# Altium schematic sheet Power&CH341A.SchDoc
size A4
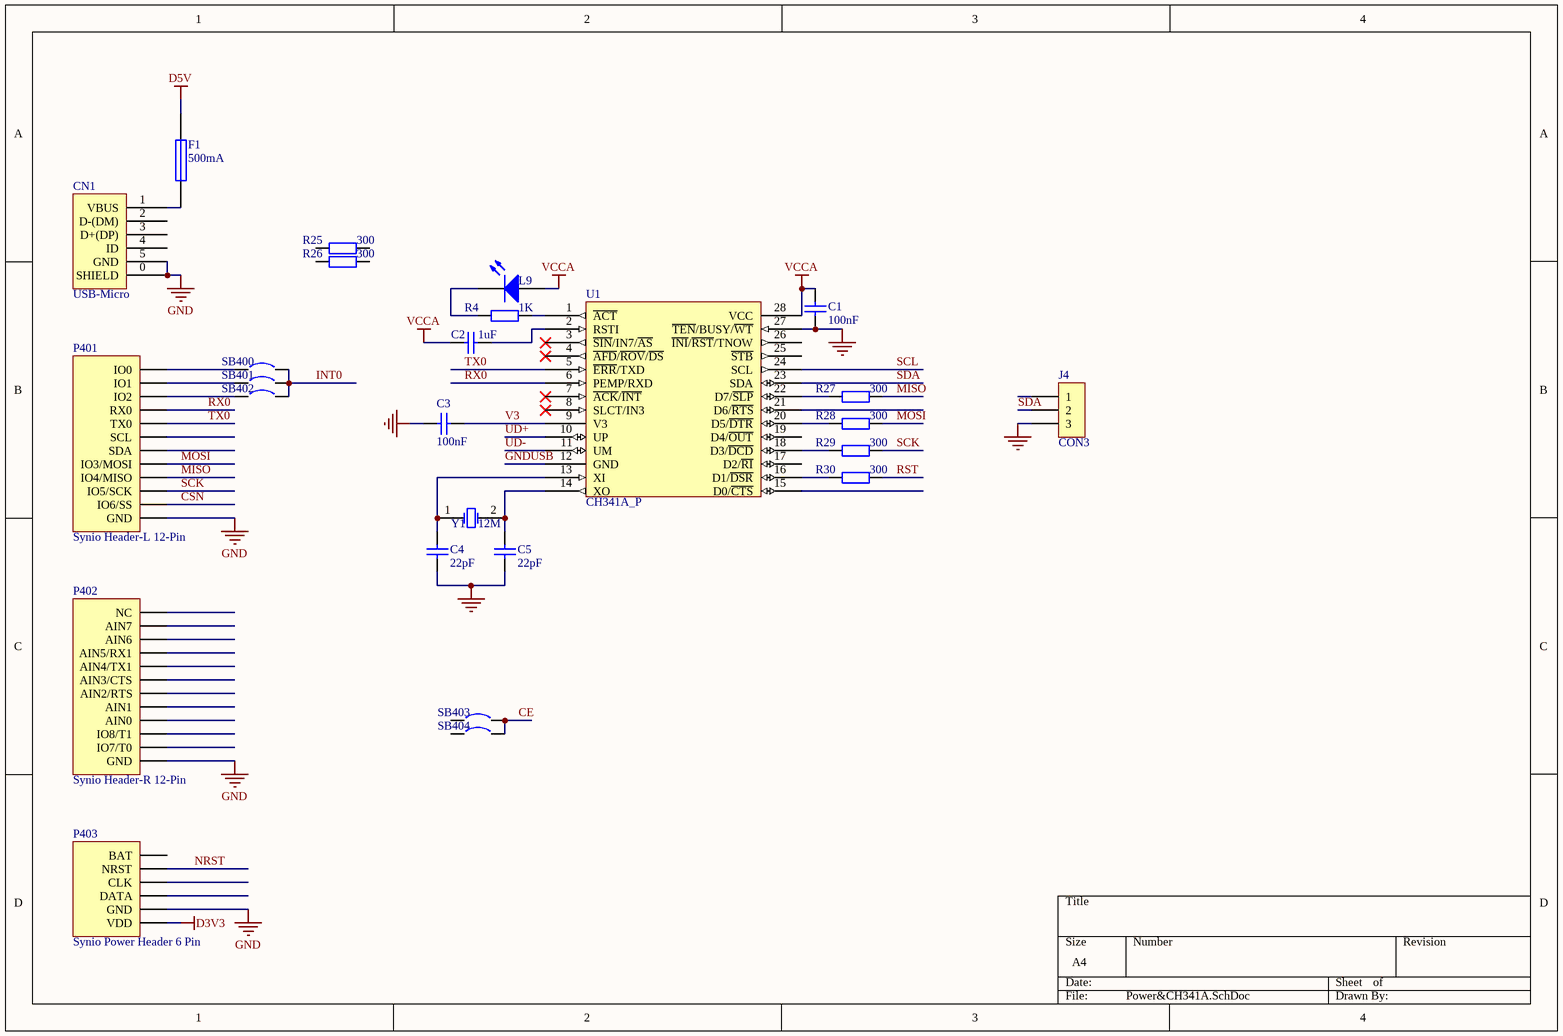
[diagram p0: Power&CH341A.SchDoc]

## Parts
C1  value 100nF  [C0603L]  (hidden comment: Cap)
C2  value 1uF  [C0603L]  (hidden comment: Cap)
C3  value 100nF  [C0603L]  (hidden comment: Cap)
C4  value 22pF  [C0603L]  (hidden comment: Cap)
C5  value 22pF  [C0603L]  (hidden comment: Cap)
CN1  USB-Micro  [USB-MICRO-Female-Lite]
F1  500mA  [0805]
J4  CON3  [HDR1X3]
L9  LED  [0603pn]  (value not drawn)
P401  Synio Header-L 12-Pin  [HDR1X12-L/2.54MM]
P402  Synio Header-R 12-Pin  [HDR1X12-L/2.54MM]
P403  Synio Power Header 6 Pin  [HDR1X6-L/2.54MM]
R4  value 1K  [R0603]  (hidden comment: Res)
R25  value 300  [R0603]  (hidden comment: Res)
R26  value 300  [R0603]  (hidden comment: Res)
R27  value 300  [R0603]  (hidden comment: Res)
R28  value 300  [R0603]  (hidden comment: Res)
R29  value 300  [R0603]  (hidden comment: Res)
R30  value 300  [R0603]  (hidden comment: Res)
SB400  Circuit Breaker  [JP2_SMD]  (value not drawn)
SB401  Circuit Breaker  [JP2_SMD]  (value not drawn)
SB402  Circuit Breaker  [JP2_SMD]  (value not drawn)
SB403  Circuit Breaker  [JP2_SMD]  (value not drawn)
SB404  Circuit Breaker  [JP2_SMD]  (value not drawn)
U1  CH341A_P  [SO28_M]
Y1  value 12M  [XTAL_49S]  (hidden comment: XTAL)

## Nets
D3V3: P403.1(VDD)
D5V: F1.1
GND: CN1.0(SHIELD) CN1.5(GND) P401.1(GND) P402.1(GND) P403.2(GND)
GNDUSB: C1.1 C3.2 C4.1 C5.1 J4.3 U1.12(GND) U1.27(~{TEN}/BUSY/~{WT})
VCCA: C1.2 C2.2 L9.1(A) U1.28(VCC)
CE: SB403.2 SB404.2
CSN: P401.2(IO6/SS)
INT0: SB400.2 SB401.2 SB402.2
MISO: P401.4(IO4/MISO) R27.2
MOSI: P401.5(IO3/MOSI) R28.2
NRST: P403.5(NRST)
RST: R30.2
RX0: P401.9(RX0) U1.6(PEMP/RXD)
SCK: P401.3(IO5/SCK) R29.2
SCL: U1.24(SCL)
SDA: J4.2 U1.23(SDA)
TX0: P401.8(TX0) U1.5(~{ERR}/TXD)
UD+: U1.10(UP)
UD-: U1.11(UM)
V3: C3.1 U1.9(V3)
NetC2_1: C2.1 U1.2(RSTI)
NetC4_2: C4.2 U1.13(XI) Y1.1(OSC1)
NetC5_2: C5.2 U1.14(XO) Y1.2(OSC2)
NetCN1_1: CN1.1(VBUS) F1.2
NetL9_2: L9.2(K) R4.1
NetP401_10: P401.10(IO2) SB402.1
NetP401_11: P401.11(IO1) SB401.1
NetP401_12: P401.12(IO0) SB400.1
NetR4_2: R4.2 U1.1(~{ACT})
NetR27_1: R27.1 U1.22(D7/~{SLP})
NetR28_1: R28.1 U1.20(D5/~{DTR})
NetR29_1: R29.1 U1.18(D3/~{DCD})
NetR30_1: R30.1 U1.16(D1/~{DSR})

Not connected (* = marked no-connect by the designer): CN1 2(D-(DM)) 3(D+(DP)) 4(ID); J4 1; P401 6(SDA) 7(SCL); P402 2(IO7/T0) 3(IO8/T1) 4(AIN0) 5(AIN1) 6(AIN2/RTS) 7(AIN3/CTS) 8(AIN4/TX1) 9(AIN5/RX1) 10(AIN6) 11(AIN7) 12(NC); P403 3(DATA) 4(CLK) 6(BAT); R25 1 2; R26 1 2; SB403 1; SB404 1; U1 3(~{SIN}/IN7/~{AS})* 4(~{AFD}/~{ROV}/~{DS})* 7(~{ACK}/~{INT})* 8(SLCT/IN3)* 15(D0/~{CTS}) 17(D2/~{RI}) 19(D4/~{OUT}) 21(D6/~{RTS}) 25(~{STB}) 26(~{INI}/~{RST}/TNOW)

## Library data of the parts
C1-C5 = Cap: Capacitor; Published: 8-Jun-2000; LatestRevisionDate: 17-Jul-2002; LatestRevisionNote: Re-released for DXP Platform.; PackageReference: RAD-0.3; Publisher: Altium Limited
F1 = Fuse 1: Fuse; Published: 8-Jun-2000; LatestRevisionDate: 17-Jul-2002; LatestRevisionNote: Re-released for DXP Platform.; PackageReference: PIN-W2/E2.8; Publisher: Altium Limited; PackageDescription: Thru-Hole; 2 Leads
J4 = CON3: CON 3-Pin; LatestRevisionDate: 17-Jul-2002; LatestRevisionNote: Re-released for DXP Platform.; Publisher: Altium Limited
L9 = LED: Typical RED, GREEN, YELLOW, AMBER GaAs LED; Published: 8-Jun-2000; LatestRevisionDate: 17-Jul-2002; LatestRevisionNote: Re-released for DXP Platform.; PackageDocument: Feb-2002; PackageReference: 3.2X1.6X1.1; Publisher: Altium Limited
P401 = Synio Header-L 12-Pin: Synio Header-L, 12-Pin; LatestRevisionDate: 17-Jul-2002; LatestRevisionNote: Re-released for DXP Platform.; Publisher: Altium Limited
P402 = Synio Header-R 12-Pin: Synio Header-R, 12-Pin; LatestRevisionDate: 17-Jul-2002; LatestRevisionNote: Re-released for DXP Platform.; Publisher: Altium Limited
R4 R25-R30 = Res: Resistor; Published: 8-Jun-2000; LatestRevisionDate: 17-Jul-2002; LatestRevisionNote: Re-released for DXP Platform.; PackageReference: AXIAL-0.4; Publisher: Altium Limited
SB400-SB404 = Circuit Breaker: Solder: YES; Published: 24-Mar-1999; Revision: July-2002: Re-released for DXP Platform.; Publisher: Altium Limited
U1 = CH341A: USB bus convert chip
Y1 = XTAL: Crystal Oscillator; Published: 8-Jun-2000; LatestRevisionDate: 17-Jul-2002; LatestRevisionNote: Re-released for DXP Platform.; PackageReference: R38; Publisher: Altium Limited